# EasyEDA Pro project sensor-coils-example-3.epro

# Board 2024-06-03_06-30-53
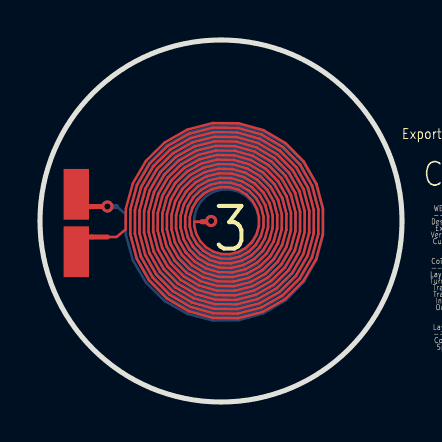
[diagram p0: board, top side]
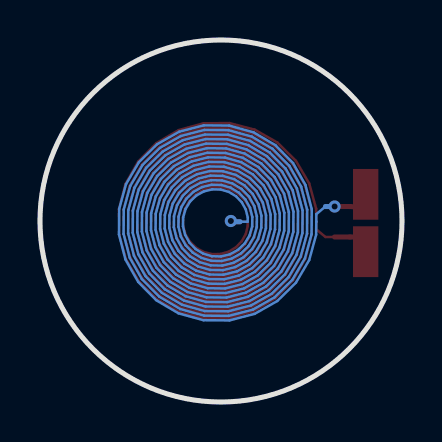
[diagram p1: board, bottom side, seen from below]

Outline 18.11 x 18.11 mm; copper layers: Top Layer, Bottom Layer. Coordinates in mm from the lower left corner of the outline.
Outline path: circle c9.06,9.06 r9.06
Stack: Top Layer 0.035mm - / Dielectric1 1.51mm FR4 er 4.5 / Bottom Layer 0.035mm -

## Design rules (mm)
template: 用户自定义配置
spacing safeClearance (default): track to track 0.152, other pairs 0.152 to 0.3
track width trackWidth (default): min 0.025, default 0.254, max 2.54
differential pair differentialPair (default): width min 0.127, default 0.254, max 2.54; gap min 0.152, default 0.152
via viaSize (default): diameter min 0.5, default 0.61, max 10; hole min 0.3, default 0.305, max 5.999

## Placement (name value [footprint] x y rotation side)
CSENSOR  -  [0402]  1.82 8.95 90 top

## Footprints (pads in the part's own frame, mm; a bottom-side part is the same pattern mirrored in y, then rotated)
0402
  rect 2.54x1.27 smd: 1(-1.435,0) 2(1.435,0)

## Nets
3: CSENSOR.1 CSENSOR.2

## Via types
v1: diameter 0.61, hole 0.305, Top Layer to Bottom Layer, 2 vias

## Routing (per net, layer and track width the routed paths; a pad name or vN(x,y) marks a point on that pad's centre or on a via; arc(x,y) is an arc through that point)
3: length 628.2
  Top Layer w0.127: 3.37,8.26 3.83,8.26 4.29,8.64 4.29,9.02 4.3,9.68 4.65,10.94 5.31,12.07 6.24,12.98 7.37,13.63 8.63,13.95 9.93,13.95 11.18,13.6 12.29,12.95 13.2,12.03 13.84,10.91 14.16,9.66 14.15,8.38 13.81,7.14 13.16,6.04 12.25,5.15 11.15,4.52 9.92,4.2 8.65,4.21 7.43,4.54 6.34,5.18 5.45,6.08 4.83,7.18 4.52,8.39 4.53,9.65 4.86,10.85 5.49,11.93 6.38,12.8 7.46,13.41 8.66,13.73 9.9,13.72 11.09,13.39 12.15,12.76 13.02,11.89 13.62,10.82 13.93,9.63 13.92,8.41 13.6,7.23 12.98,6.18 12.11,5.33 11.06,4.73 9.89,4.43 8.68,4.44 7.52,4.76 6.48,5.37 5.64,6.22 5.05,7.27 4.74,8.42 4.75,9.62 5.07,10.76 5.67,11.79 6.52,12.62 7.55,13.2 8.69,13.5 9.87,13.49 11,13.18 12.01,12.58 12.83,11.75 13.41,10.73 13.7,9.6 13.69,8.44 13.38,7.32 12.8,6.32 11.97,5.51 10.97,4.94 9.86,4.66 8.71,4.66 7.6,4.97 6.62,5.55 5.82,6.36 5.26,7.35 4.97,8.45 4.98,9.59 5.28,10.67 5.86,11.65 6.66,12.44 7.64,12.99 8.72,13.27 9.84,13.26 10.91,12.96 11.87,12.4 12.65,11.61 13.2,10.64 13.47,9.57 13.46,8.47 13.17,7.41 12.61,6.46 11.83,5.69 10.88,5.16 9.83,4.88 8.74,4.89 7.69,5.18 6.76,5.73 6,6.5 5.47,7.44 5.2,8.48 5.21,9.56 5.5,10.59 6.04,11.51 6.8,12.25 7.72,12.78 8.75,13.04 9.81,13.03 10.83,12.75 11.73,12.21 12.47,11.47 12.98,10.55 13.25,9.54 13.24,8.5 12.96,7.5 12.43,6.6 11.69,5.88 10.79,5.37 9.8,5.11 8.77,5.12 7.78,5.4 6.9,5.92 6.18,6.64 5.68,7.53 5.43,8.51 5.44,9.53 5.71,10.5 6.22,11.37 6.94,12.07 7.81,12.56 8.78,12.81 9.78,12.8 10.74,12.54 11.59,12.03 12.29,11.33 12.77,10.47 13.02,9.51 13.01,8.53 12.74,7.58 12.25,6.74 11.55,6.06 10.7,5.58 9.77,5.34 8.8,5.35 7.87,5.61 7.04,6.1 6.37,6.78 5.9,7.62 5.66,8.54 5.67,9.5 5.92,10.41 6.41,11.23 7.08,11.89 7.9,12.35 8.81,12.58 9.75,12.57 10.65,12.32 11.45,11.85 12.1,11.18 12.56,10.38 12.79,9.48 12.78,8.56 12.53,7.67 12.06,6.88 11.41,6.24 10.62,5.8 9.74,5.57 8.83,5.58 7.96,5.82 7.18,6.28 6.55,6.92 6.11,7.71 5.89,8.57 5.9,9.46 6.14,10.32 6.59,11.09 7.22,11.7 7.99,12.14 8.84,12.36 9.72,12.35 10.56,12.11 11.31,11.67 11.92,11.04 12.34,10.29 12.56,9.45 12.55,8.59 12.32,7.76 11.88,7.02 11.27,6.43 10.53,6.01 9.71,5.8 8.86,5.81 8.04,6.04 7.32,6.46 6.73,7.06 6.32,7.79 6.12,8.6 6.13,9.43 6.35,10.23 6.77,10.94 7.36,11.52 8.08,11.92 8.87,12.13 9.69,12.12 10.47,11.9 11.17,11.48 11.74,10.9 12.13,10.2 12.33,9.42 12.32,8.62 12.11,7.85 11.7,7.16 11.13,6.61 10.44,6.22 9.67,6.03 8.89,6.04 8.13,6.25 7.46,6.65 6.92,7.2 6.54,7.88 6.34,8.63 6.35,9.4 6.56,10.15 6.95,10.8 7.5,11.34 8.17,11.71 8.9,11.9 9.66,11.89 10.38,11.68 11.03,11.3 11.55,10.76 11.92,10.11 12.1,9.39 12.09,8.65 11.89,7.94 11.52,7.3 10.99,6.79 10.35,6.43 9.64,6.26 8.92,6.26 8.22,6.46 7.6,6.83 7.1,7.35 6.75,7.97 6.57,8.66 6.58,9.37 6.78,10.06 7.14,10.66 7.64,11.16 8.25,11.5 8.93,11.67 9.63,11.66 10.3,11.47 10.89,11.12 11.37,10.62 11.71,10.02 11.87,9.36 11.86,8.68 11.68,8.03 11.33,7.44 10.85,6.98 10.26,6.65 9.61,6.48 8.95,6.49 8.31,6.67 7.74,7.01 7.28,7.49 6.96,8.06 6.8,8.69 6.81,9.34 6.99,9.97 7.32,10.52 7.78,10.97 8.34,11.28 8.96,11.44 9.6,11.43 10.21,11.26 10.75,10.93 11.19,10.48 11.49,9.94 11.65,9.33 11.64,8.71 11.47,8.11 11.15,7.59 10.71,7.16 10.18,6.86 9.58,6.71 8.98,6.72 8.4,6.89 7.88,7.2 7.47,7.63 7.18,8.15 7.03,8.72 7.04,9.31 7.2,9.88 7.5,10.38 7.92,10.79 8.43,11.07 8.99,11.21 9.57,11.2 10.12,11.05 10.61,10.75 11,10.34 11.28,9.85 11.42,9.3 11.41,8.74 11.25,8.2 10.97,7.73 10.57,7.34 10.09,7.07 9.55,6.94 9.01,6.95 8.49,7.1 8.02,7.38 7.65,7.77 7.39,8.24 7.26,8.75 7.27,9.28 7.41,9.79 7.69,10.24 8.06,10.61 8.52,10.86 9.02,10.98 9.54,10.97 10.03,10.83 10.47,10.57 10.82,10.2 11.07,9.76 11.19,9.27 11.18,8.77 11.04,8.29 10.78,7.87 10.43,7.52 10,7.29 9.52,7.17 9.04,7.18 8.57,7.31 8.16,7.56 7.83,7.91 7.6,8.32 7.49,8.78 7.5,9.25 7.63,9.7 7.87,10.1 8.2,10.42 8.61,10.65 9.05,10.76 9.51,10.75 9.94,10.62 10.33,10.39 10.64,10.06 10.85,9.67 10.96,9.24 10.95,8.8 10.83,8.38 10.6,8.01 10.29,7.71 9.91,7.5 9.49,7.4 9.07,7.41 8.66,7.53 8.3,7.75 8.01,8.05 7.81,8.41 7.72,8.81 7.73,9.02 8.1,9.02
  Top Layer w0.254: 1.82,8.26 3.37,8.26 ; 8.1,9.02 8.48,9.02 ; v1(3.37,9.78) 2.6,9.78 1.82,9.72 1.82,9.65
  Bottom Layer w0.127: 8.1,9.02 7.73,9.02 7.72,9.23 7.81,9.63 8.01,9.99 8.3,10.29 8.66,10.51 9.07,10.63 9.49,10.64 9.91,10.54 10.29,10.33 10.6,10.03 10.83,9.66 10.95,9.24 10.96,8.8 10.85,8.37 10.64,7.98 10.33,7.65 9.94,7.42 9.51,7.29 9.05,7.28 8.61,7.39 8.2,7.62 7.87,7.94 7.63,8.33 7.5,8.78 7.49,9.26 7.6,9.72 7.83,10.13 8.16,10.48 8.57,10.73 9.04,10.86 9.52,10.87 10,10.75 10.43,10.52 10.78,10.17 11.04,9.75 11.18,9.27 11.19,8.77 11.07,8.28 10.82,7.84 10.47,7.47 10.03,7.21 9.54,7.06 9.02,7.06 8.52,7.18 8.06,7.43 7.69,7.8 7.41,8.25 7.27,8.75 7.26,9.29 7.39,9.8 7.65,10.27 8.02,10.66 8.49,10.94 9.01,11.09 9.55,11.1 10.09,10.97 10.57,10.7 10.97,10.31 11.25,9.84 11.41,9.3 11.42,8.74 11.28,8.19 11,7.7 10.61,7.29 10.12,6.99 9.57,6.84 8.99,6.83 8.43,6.97 7.92,7.25 7.5,7.66 7.2,8.16 7.04,8.72 7.03,9.32 7.18,9.89 7.47,10.41 7.88,10.84 8.4,11.15 8.98,11.32 9.58,11.33 10.18,11.18 10.71,10.88 11.15,10.45 11.47,9.92 11.64,9.33 11.65,8.71 11.49,8.1 11.19,7.56 10.75,7.1 10.21,6.78 9.6,6.61 8.96,6.6 8.34,6.75 7.78,7.07 7.32,7.52 6.99,8.07 6.81,8.69 6.8,9.35 6.96,9.98 7.28,10.55 7.74,11.03 8.31,11.36 8.95,11.55 9.61,11.56 10.26,11.39 10.85,11.06 11.33,10.59 11.68,10.01 11.86,9.36 11.87,8.68 11.71,8.02 11.37,7.42 10.89,6.92 10.3,6.57 9.63,6.38 8.93,6.37 8.25,6.54 7.64,6.88 7.14,7.37 6.78,7.98 6.58,8.66 6.57,9.38 6.75,10.07 7.1,10.69 7.6,11.21 8.22,11.58 8.92,11.77 9.64,11.78 10.35,11.6 10.99,11.25 11.52,10.73 11.89,10.1 12.09,9.39 12.1,8.65 11.92,7.93 11.55,7.28 11.03,6.74 10.38,6.35 9.66,6.15 8.9,6.14 8.17,6.33 7.5,6.7 6.95,7.23 6.56,7.89 6.35,8.63 6.34,9.41 6.54,10.16 6.92,10.83 7.46,11.39 8.13,11.79 8.89,12 9.67,12.01 10.44,11.82 11.13,11.43 11.7,10.87 12.11,10.19 12.32,9.42 12.33,8.62 12.13,7.84 11.74,7.14 11.17,6.56 10.47,6.14 9.69,5.92 8.87,5.91 8.08,6.12 7.36,6.52 6.77,7.09 6.35,7.81 6.13,8.6 6.12,9.44 6.32,10.24 6.73,10.97 7.32,11.57 8.04,12 8.86,12.23 9.71,12.24 10.53,12.03 11.27,11.61 11.88,11.02 12.32,10.28 12.55,9.45 12.56,8.59 12.34,7.75 11.92,6.99 11.31,6.37 10.56,5.93 9.72,5.69 8.84,5.68 7.99,5.9 7.22,6.33 6.59,6.95 6.14,7.72 5.9,8.57 5.89,9.47 6.11,10.33 6.55,11.11 7.18,11.76 7.96,12.22 8.83,12.46 9.74,12.47 10.62,12.24 11.41,11.8 12.06,11.16 12.53,10.37 12.78,9.48 12.79,8.56 12.56,7.66 12.1,6.85 11.45,6.19 10.65,5.72 9.75,5.46 8.81,5.45 7.9,5.69 7.08,6.15 6.41,6.81 5.92,7.63 5.67,8.54 5.66,9.5 5.9,10.42 6.37,11.25 7.04,11.94 7.87,12.43 8.8,12.69 9.77,12.7 10.7,12.46 11.55,11.98 12.25,11.3 12.74,10.45 13.01,9.51 13.02,8.53 12.77,7.57 12.29,6.71 11.59,6.01 10.74,5.5 9.78,5.24 8.78,5.23 7.81,5.48 6.94,5.97 6.22,6.67 5.71,7.54 5.44,8.51 5.43,9.53 5.68,10.51 6.18,11.4 6.9,12.12 7.78,12.64 8.77,12.92 9.8,12.93 10.79,12.67 11.69,12.16 12.43,11.44 12.96,10.54 13.24,9.54 13.25,8.5 12.98,7.49 12.47,6.57 11.73,5.82 10.83,5.29 9.81,5.01 8.75,5 7.72,5.26 6.8,5.79 6.04,6.53 5.5,7.45 5.21,8.48 5.2,9.56 5.47,10.6 6,11.54 6.76,12.31 7.69,12.86 8.74,13.15 9.83,13.16 10.88,12.88 11.83,12.34 12.61,11.58 13.17,10.63 13.46,9.57 13.47,8.47 13.2,7.4 12.65,6.43 11.87,5.64 10.91,5.08 9.84,4.78 8.72,4.77 7.64,5.05 6.66,5.6 5.86,6.39 5.28,7.36 4.98,8.45 4.97,9.59 5.26,10.69 5.82,11.68 6.62,12.49 7.6,13.07 8.71,13.37 9.86,13.38 10.97,13.09 11.97,12.53 12.8,11.72 13.38,10.72 13.69,9.6 13.7,8.44 13.41,7.31 12.83,6.29 12.01,5.46 11,4.86 9.87,4.55 8.69,4.54 7.55,4.84 6.52,5.42 5.67,6.25 5.07,7.28 4.75,8.42 4.74,9.62 5.05,10.77 5.64,11.82 6.48,12.67 7.52,13.28 8.68,13.6 9.89,13.61 11.06,13.31 12.11,12.71 12.98,11.86 13.6,10.81 13.92,9.63 13.93,8.41 13.62,7.22 13.02,6.15 12.15,5.28 11.09,4.65 9.9,4.32 8.66,4.31 7.46,4.62 6.38,5.24 5.49,6.11 4.86,7.19 4.53,8.39 4.52,9.65 4.83,10.86 5.45,11.96 6.34,12.85 7.43,13.49 8.65,13.83 9.92,13.84 11.15,13.52 12.25,12.89 13.16,12 13.81,10.9 14.15,9.66 14.16,8.38 13.84,7.13 13.2,6.01 12.29,5.09 11.18,4.44 9.93,4.09 8.63,4.08 7.37,4.41 6.24,5.05 5.31,5.97 4.65,7.1 4.3,8.36 4.29,9.02 4.29,9.4 3.83,9.78
  Bottom Layer w0.254: 3.83,9.78 v1(3.37,9.78) ; 8.1,9.02 8.48,9.02
  vias: v1(8.56,9.06)

## Text on the board
Top Silkscreen Layer: Layers = 2 | Turns = 15 | Version - 1.1 | -------------- | Design Id - 109 | Coil Parameters | Customized for LDC1612 | Trace Width = 5.0 mils | Layer Stack Information | Trace Spacing = 4.0 mils | ------------------------- | WEBENCH Design Information | Copper thickness = 1.0 Oz-Cu | Exported on - 2024/06/03 06:30:51 | Inner Diameter = 123 mils (Approx.) | Outer Diameter = 394 mils (Approx.) | Space between TOP and BOTTOM = 4.0 mils | Exported from WEBENCH Coil Designer Tool | 3
